# EAGLE schematic padControllerR3 (EAGLE 9.0.0)
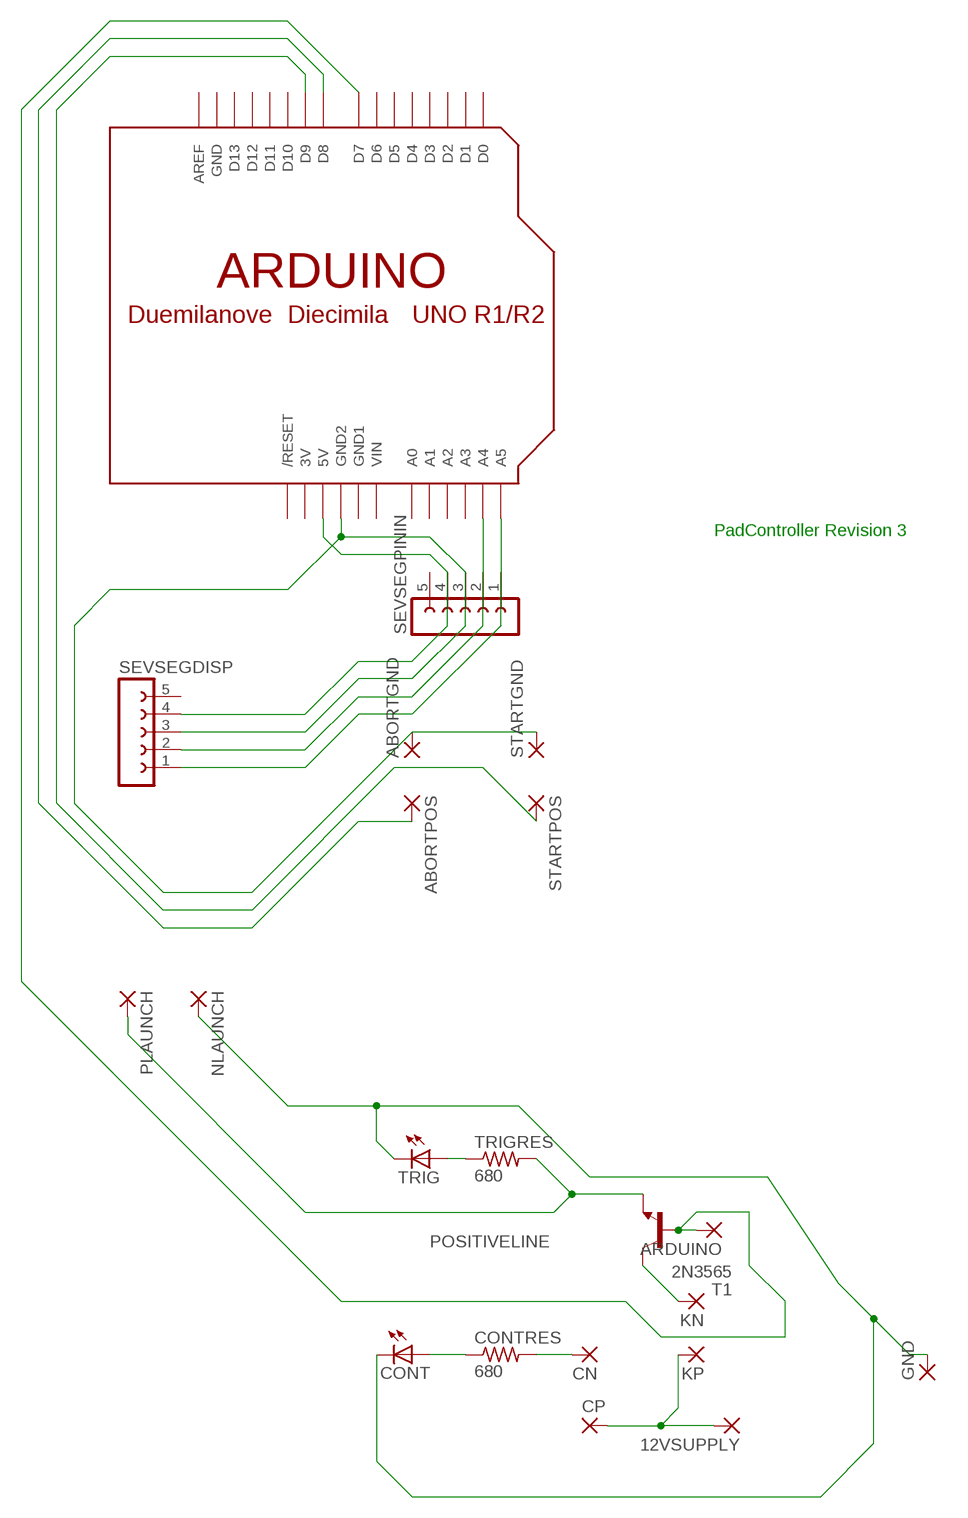
[diagram p0: schematic, sheet 1]

## Parts
12VSUPPLY  3,17/1,1  [3,17/1,1]
ABORTGND  3,17/1,3  [3,17/1,3]
ABORTPOS  3,17/1,3  [3,17/1,3]
ARDUINO  3,17/1,3  [3,17/1,3]
CN  3,17/1,3  [3,17/1,3]
CONT  LED3MM  [LED3MM]
CONTRES  680  R-US_0207/7  [0207/7]
CP  3,17/1,3  [3,17/1,3]
GND  3,17/1,1  [3,17/1,1]
KN  3,17/1,3  [3,17/1,3]
KP  3,17/1,3  [3,17/1,3]
NLAUNCH  3,17/1,1  [3,17/1,1]
PLAUNCH  3,17/1,1  [3,17/1,1]
SEVSEGDISP  FE05-1  [FE05-1]
SEVSEGPININ  FE05-1  [FE05-1]
STARTGND  3,17/1,3  [3,17/1,3]
STARTPOS  3,17/1,3  [3,17/1,3]
T1  2N3565  [TO92]
TRIG  LED3MM  [LED3MM]
TRIGRES  680  R-US_0207/7  [0207/7]
U$1  ARDUINO-NOHOLE  [ARDUINO-NOHOLE]

## Nets
N$1: 12VSUPPLY.1(P) CP.1(P) KP.1(P)
N$2: KN.1(P) T1.1(C)
N$3: ABORTPOS.1(P) U$1.D8
N$4: SEVSEGDISP.4 SEVSEGPININ.4 U$1.5V
N$6: TRIG.A TRIGRES.1
N$7: CONT.K(C) GND.1(P) NLAUNCH.1(P) TRIG.K(C)
N$8: CN.1(P) CONTRES.2
N$9: CONT.A CONTRES.1
N$12: ARDUINO.1(P) T1.2(B) U$1.D7
N$15: STARTPOS.1(P) U$1.D9
N$16: ABORTGND.1(P) SEVSEGDISP.3 SEVSEGPININ.3 STARTGND.1(P) U$1.GND2
N$17: SEVSEGDISP.2 SEVSEGPININ.2 U$1.A4
N$18: SEVSEGDISP.1 SEVSEGPININ.1 U$1.A5
POSITIVELINE: PLAUNCH.1(P) T1.3(E) TRIGRES.2
Unconnected: SEVSEGDISP.5 SEVSEGPININ.5 U$1.A0 U$1.A1 U$1.A2 U$1.A3 U$1.AREF U$1.D0 U$1.D1 U$1.D2 U$1.D3 U$1.D4 U$1.D5 U$1.D6 U$1.D10 U$1.D11 U$1.D12 U$1.D13 U$1.RESET(/RESET)

## Notes on the sheet
- PadController Revision 3

## Power pins joined to a net without a drawn wire
3V: U$1.3V
GND: U$1.GND
GND1: U$1.GND1
VIN: U$1.VIN

## Library data of the parts
12VSUPPLY GND NLAUNCH PLAUNCH = wirepad:3,17/1,1: THROUGH-HOLE PAD
ABORTGND ABORTPOS ARDUINO CN CP KN KP STARTGND STARTPOS = wirepad:3,17/1,3: THROUGH-HOLE PAD
CONT TRIG = led:LED: LED OSRAM: - CHIPLED LG R971, LG N971, LY N971, LG Q971, LY Q971, LO R971, LY R971 LH N974, LH R974 LS Q976, LO Q976, LY Q976 LO Q996 - Hyper CHIPLED LW Q18S LB Q993, LB Q99A, LB R99A - SideLED LS A670, LO A670, LY A670, LG A670, LP A670 LB A673, LV A673, LT A673, LW A673 LH A674 LY A675 LS A676, LA A676, LO A676, LY A676, LW A676 LS A679, LY A679, LG A679 - Hyper Micro SIDELED® LS Y876, LA Y876, LO Y876, LY Y876 LT Y87S - SmartLED LW L88C, LW L88S LB L89C, LB L89S, LG L890 LS L89K, LO L89K, LY L89K LS L896, LA L896, LO L896, LY L896 - TOPLED LS T670, LO T670, LY T670, LG T670, LP T670 LSG T670, LSP T670, LSY T670, LOP T670, LYG T670 LG T671, LOG T671, LSG T671 LB T673, LV T673, LT T673, LW T673 LH T674 LS T676, LA T676, LO T676, LY T676, LB T676, LH T676, LSB T676, LW T676 LB T67C, LV T67C, LT T67C, LS T67K, LO T67K, LY T67K, LW E67C LS E67B, LA E67B, LO E67B, LY E67B, LB E67C, LV E67C, LT E67C LW T67C LS T679, LY T679, LG T679 LS T770, LO T770, LY T770, LG T770, LP T770 LB T773, LV T773, LT T773, LW T773 LH T774 LS E675, LA E675, LY E675, LS T675 LS T776, LA T776, LO T776, LY T776, LB T776 LHGB T686 LT T68C, LB T68C - Hyper Mini TOPLED® LB M676 - Mini TOPLED Santana® LG M470 LS M47K, LO M47K, LY M47K Source: http://www.osram.convergy.de LUXEON: - LUMILED® LXK2-PW12-R00, LXK2-PW12-S00, LXK2-PW14-U00, LXK2-PW14-V00 LXK2-PM12-R00, LXK2-PM12-S00, LXK2-PM14-U00 LXK2-PE12-Q00, LXK2-PE12-R00, LXK2-PE12-S00, LXK2-PE14-T00, LXK2-PE14-U00 LXK2-PB12-K00, LXK2-PB12-L00, LXK2-PB12-M00, LXK2-PB14-N00, LXK2-PB14-P00, LXK2-PB14-Q00 LXK2-PR12-L00, LXK2-PR12-M00, LXK2-PR14-Q00, LXK2-PR14-R00 LXK2-PD12-Q00, LXK2-PD12-R00, LXK2-PD12-S00 LXK2-PH12-R00, LXK2-PH12-S00 LXK2-PL12-P00, LXK2-PL12-Q00, LXK2-PL12-R00 Source: www.luxeon.com KINGBRIGHT: KA-3528ASYC Source: www.kingbright.com
CONTRES TRIGRES = resistor:R-US_: RESISTOR, American symbol
SEVSEGDISP SEVSEGPININ = con-lsta:FE05-1: FEMALE HEADER; OC_FARNELL: unknown; OC_NEWARK: unknown
T1 = transistor:2N3565: NPN TRANSISTOR
U$1 = adafruit:ARDUINO: Arduino Diecimila/Duemilanove Make a shield with ease, this package has all the named pins as well as the two mounting drill holes and an outline of the USB and DC power connector. The outline is on the DIMENSION layer, so if your board house uses it they will cut the outline to match. http://www.ladyada.net/library/pcb/eaglelibrary.html